# Altium schematic sheet Master.SchDoc
size A; SheetNumber: 1; SheetTotal: 9
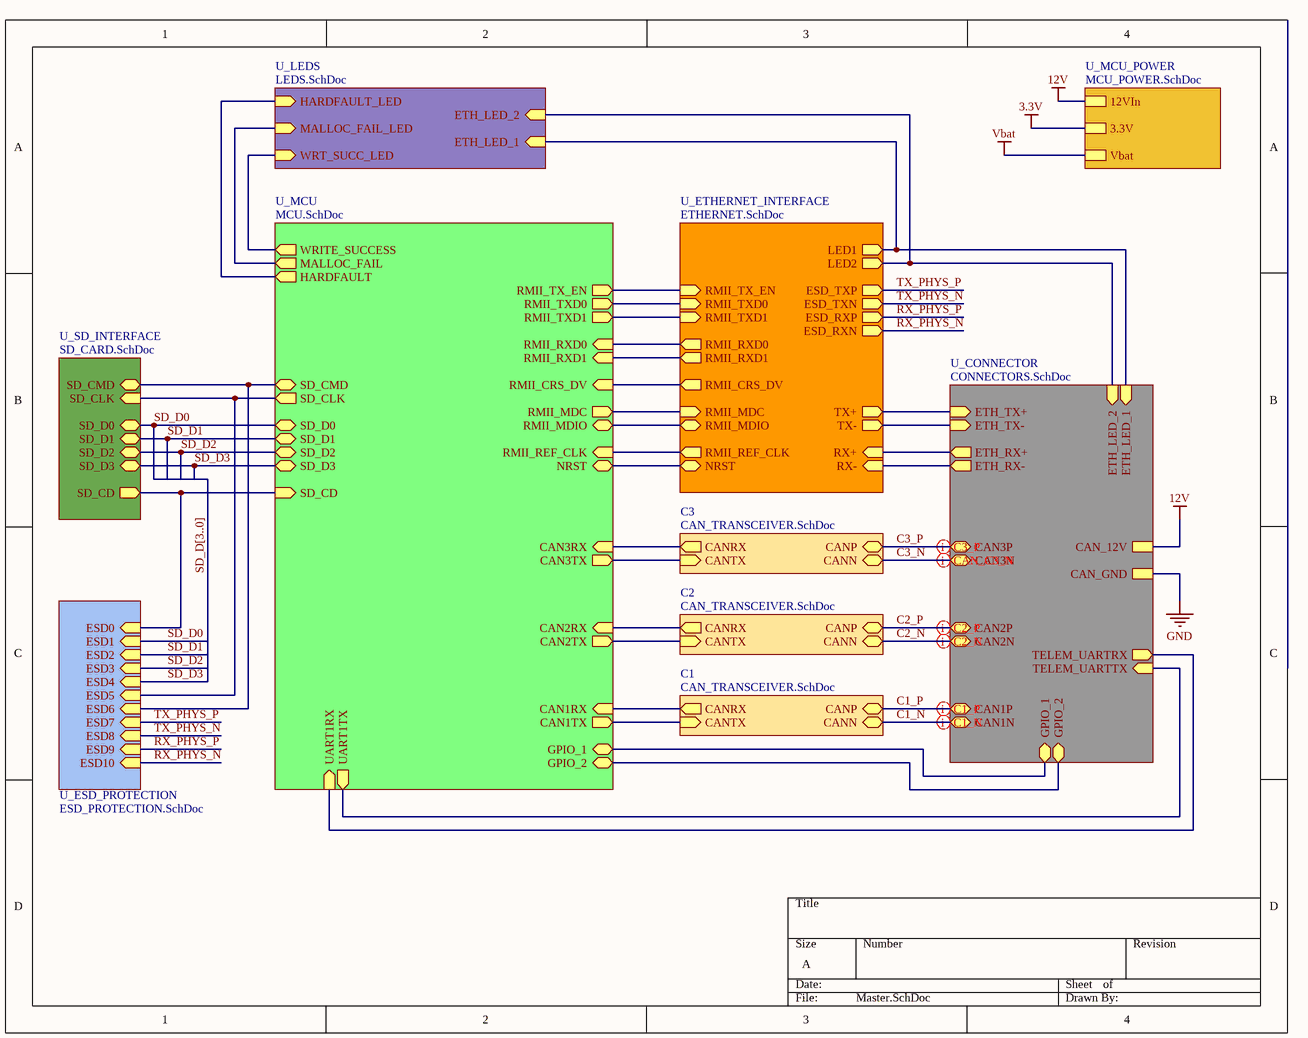
[diagram p0: Master.SchDoc]

## Sub-sheets
C1 = CAN_TRANSCEIVER.SchDoc: CANTX (in), CANP (bidir), CANN (bidir), CANRX (out)
C2 = CAN_TRANSCEIVER.SchDoc: CANTX (in), CANP (bidir), CANN (bidir), CANRX (out)
C3 = CAN_TRANSCEIVER.SchDoc: CANTX (in), CANP (bidir), CANN (bidir), CANRX (out)
U_CONNECTOR = CONNECTORS.SchDoc: ETH_TX+ (in), ETH_TX- (in), ETH_RX+ (out), ETH_RX- (out), CAN3P (bidir), CAN3N (bidir), CAN2P (bidir), CAN2N (bidir), CAN1P (bidir), CAN1N (bidir), TELEM_UARTTX (in), TELEM_UARTRX (out), CAN_12V, CAN_GND, ETH_LED_2 (in), ETH_LED_1 (in), GPIO_1 (bidir), GPIO_2 (bidir)
U_ESD_PROTECTION = ESD_PROTECTION.SchDoc: ESD0 (in), ESD1 (in), ESD2 (in), ESD3 (in), ESD4 (in), ESD5 (in), ESD6 (in), ESD7 (in), ESD8 (in), ESD9 (in), ESD10 (in)
U_ETHERNET_INTERFACE = ETHERNET.SchDoc: RMII_TX_EN (in), RMII_TXD0 (in), RMII_TXD1 (in), RMII_RXD0 (out), RMII_RXD1 (out), RMII_CRS_DV (out), RMII_MDC (in), RMII_MDIO (bidir), RMII_REF_CLK (out), TX+ (out), TX- (out), RX+ (in), RX- (in), LED1 (out), LED2 (out), NRST (bidir), ESD_TXP (out), ESD_TXN (out), ESD_RXP (out), ESD_RXN (out)
U_LEDS = LEDS.SchDoc: WRT_SUCC_LED (in), MALLOC_FAIL_LED (in), HARDFAULT_LED (in), ETH_LED_1 (in), ETH_LED_2 (in)
U_MCU = MCU.SchDoc: CAN1TX (out), CAN1RX (in), WRITE_SUCCESS (out), CAN2RX (in), CAN2TX (out), CAN3TX (out), CAN3RX (in), NRST (bidir), UART1TX (out), UART1RX (in), SD_CMD (bidir), SD_CLK (out), SD_D0 (bidir), SD_D1 (bidir), SD_D3 (bidir), SD_D2 (bidir), SD_CD (in), MALLOC_FAIL (out), HARDFAULT (out), RMII_TX_EN (out), RMII_TXD0 (out), RMII_TXD1 (out), RMII_RXD0 (in), RMII_RXD1 (in), RMII_CRS_DV (in), RMII_MDC (out), RMII_MDIO (bidir), RMII_REF_CLK (in), GPIO_1 (bidir), GPIO_2 (bidir)
U_MCU_POWER = MCU_POWER.SchDoc: 12VIn, 3.3V, Vbat
U_SD_INTERFACE = SD_CARD.SchDoc: SD_CMD (bidir), SD_CLK (in), SD_D0 (bidir), SD_D1 (bidir), SD_D2 (bidir), SD_D3 (bidir), SD_CD (out)

## Nets
3.3V: sheet U_MCU_POWER/3.3V
12V: sheet U_MCU_POWER/12VIn, sheet U_CONNECTOR/CAN_12V
GND: sheet U_CONNECTOR/CAN_GND
Vbat: sheet U_MCU_POWER/Vbat
C1_N: sheet C1/CANN, sheet U_CONNECTOR/CAN1N
C1_P: sheet C1/CANP, sheet U_CONNECTOR/CAN1P
C2_N: sheet C2/CANN, sheet U_CONNECTOR/CAN2N
C2_P: sheet C2/CANP, sheet U_CONNECTOR/CAN2P
C3_N: sheet C3/CANN, sheet U_CONNECTOR/CAN3N
C3_P: sheet C3/CANP, sheet U_CONNECTOR/CAN3P
RX_PHYS_N: sheet U_ETHERNET_INTERFACE/ESD_RXN, sheet U_ESD_PROTECTION/ESD10
RX_PHYS_P: sheet U_ETHERNET_INTERFACE/ESD_RXP, sheet U_ESD_PROTECTION/ESD9
SD_D0: sheet U_MCU/SD_D0, sheet U_SD_INTERFACE/SD_D0, sheet U_ESD_PROTECTION/ESD1
SD_D1: sheet U_MCU/SD_D1, sheet U_SD_INTERFACE/SD_D1, sheet U_ESD_PROTECTION/ESD2
SD_D2: sheet U_MCU/SD_D2, sheet U_SD_INTERFACE/SD_D2, sheet U_ESD_PROTECTION/ESD3
SD_D3: sheet U_MCU/SD_D3, sheet U_SD_INTERFACE/SD_D3, sheet U_ESD_PROTECTION/ESD4
TX_PHYS_N: sheet U_ETHERNET_INTERFACE/ESD_TXN, sheet U_ESD_PROTECTION/ESD8
TX_PHYS_P: sheet U_ETHERNET_INTERFACE/ESD_TXP, sheet U_ESD_PROTECTION/ESD7
(unnamed): sheet U_MCU/CAN1TX, sheet C1/CANTX
(unnamed): sheet U_MCU/CAN1RX, sheet C1/CANRX
(unnamed): sheet U_MCU/WRITE_SUCCESS, sheet U_LEDS/WRT_SUCC_LED
(unnamed): sheet U_MCU/CAN2RX, sheet C2/CANRX
(unnamed): sheet U_MCU/CAN2TX, sheet C2/CANTX
(unnamed): sheet U_MCU/CAN3TX, sheet C3/CANTX
(unnamed): sheet U_MCU/CAN3RX, sheet C3/CANRX
(unnamed): sheet U_MCU/NRST, sheet U_ETHERNET_INTERFACE/NRST
(unnamed): sheet U_MCU/UART1TX, sheet U_CONNECTOR/TELEM_UARTTX
(unnamed): sheet U_MCU/UART1RX, sheet U_CONNECTOR/TELEM_UARTRX
(unnamed): sheet U_MCU/SD_CMD, sheet U_SD_INTERFACE/SD_CMD, sheet U_ESD_PROTECTION/ESD6
(unnamed): sheet U_MCU/SD_CLK, sheet U_SD_INTERFACE/SD_CLK, sheet U_ESD_PROTECTION/ESD5
(unnamed): sheet U_MCU/SD_CD, sheet U_SD_INTERFACE/SD_CD, sheet U_ESD_PROTECTION/ESD0
(unnamed): sheet U_MCU/MALLOC_FAIL, sheet U_LEDS/MALLOC_FAIL_LED
(unnamed): sheet U_MCU/HARDFAULT, sheet U_LEDS/HARDFAULT_LED
(unnamed): sheet U_MCU/RMII_TX_EN, sheet U_ETHERNET_INTERFACE/RMII_TX_EN
(unnamed): sheet U_MCU/RMII_TXD0, sheet U_ETHERNET_INTERFACE/RMII_TXD0
(unnamed): sheet U_MCU/RMII_TXD1, sheet U_ETHERNET_INTERFACE/RMII_TXD1
(unnamed): sheet U_MCU/RMII_RXD0, sheet U_ETHERNET_INTERFACE/RMII_RXD0
(unnamed): sheet U_MCU/RMII_RXD1, sheet U_ETHERNET_INTERFACE/RMII_RXD1
(unnamed): sheet U_MCU/RMII_CRS_DV, sheet U_ETHERNET_INTERFACE/RMII_CRS_DV
(unnamed): sheet U_MCU/RMII_MDC, sheet U_ETHERNET_INTERFACE/RMII_MDC
(unnamed): sheet U_MCU/RMII_MDIO, sheet U_ETHERNET_INTERFACE/RMII_MDIO
(unnamed): sheet U_MCU/RMII_REF_CLK, sheet U_ETHERNET_INTERFACE/RMII_REF_CLK
(unnamed): sheet U_MCU/GPIO_1, sheet U_CONNECTOR/GPIO_1
(unnamed): sheet U_MCU/GPIO_2, sheet U_CONNECTOR/GPIO_2
(unnamed): sheet U_ETHERNET_INTERFACE/TX+, sheet U_CONNECTOR/ETH_TX+
(unnamed): sheet U_ETHERNET_INTERFACE/TX-, sheet U_CONNECTOR/ETH_TX-
(unnamed): sheet U_ETHERNET_INTERFACE/RX+, sheet U_CONNECTOR/ETH_RX+
(unnamed): sheet U_ETHERNET_INTERFACE/RX-, sheet U_CONNECTOR/ETH_RX-
(unnamed): sheet U_ETHERNET_INTERFACE/LED1, sheet U_LEDS/ETH_LED_1, sheet U_CONNECTOR/ETH_LED_1
(unnamed): sheet U_ETHERNET_INTERFACE/LED2, sheet U_LEDS/ETH_LED_2, sheet U_CONNECTOR/ETH_LED_2

## Buses and harness runs
bus SD_D[3..0]

## Layout directives
differential pair: C1_N, C1_P, C2_N, C2_P, C3_N, C3_P